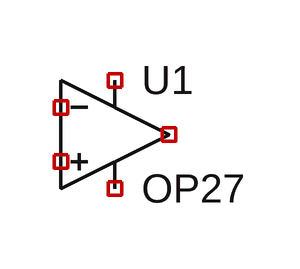
[diagram p0: schematic tia_smoke_safe_case.asc]
tia_smoke_safe_case.asc, the LTspice schematic file:
Version 4.1
SHEET 1 880 680
SYMBOL OpAmps\\OP27 112 80 R0
SYMATTR InstName U1

The netlist it stands for:
* tia_smoke_safe_case.asc
X§U1 NC_01 NC_02 NC_03 NC_04 NC_05 OP27  ; pins In+ In- V+ V- OUT
.lib ADI.lib
.backanno
.end